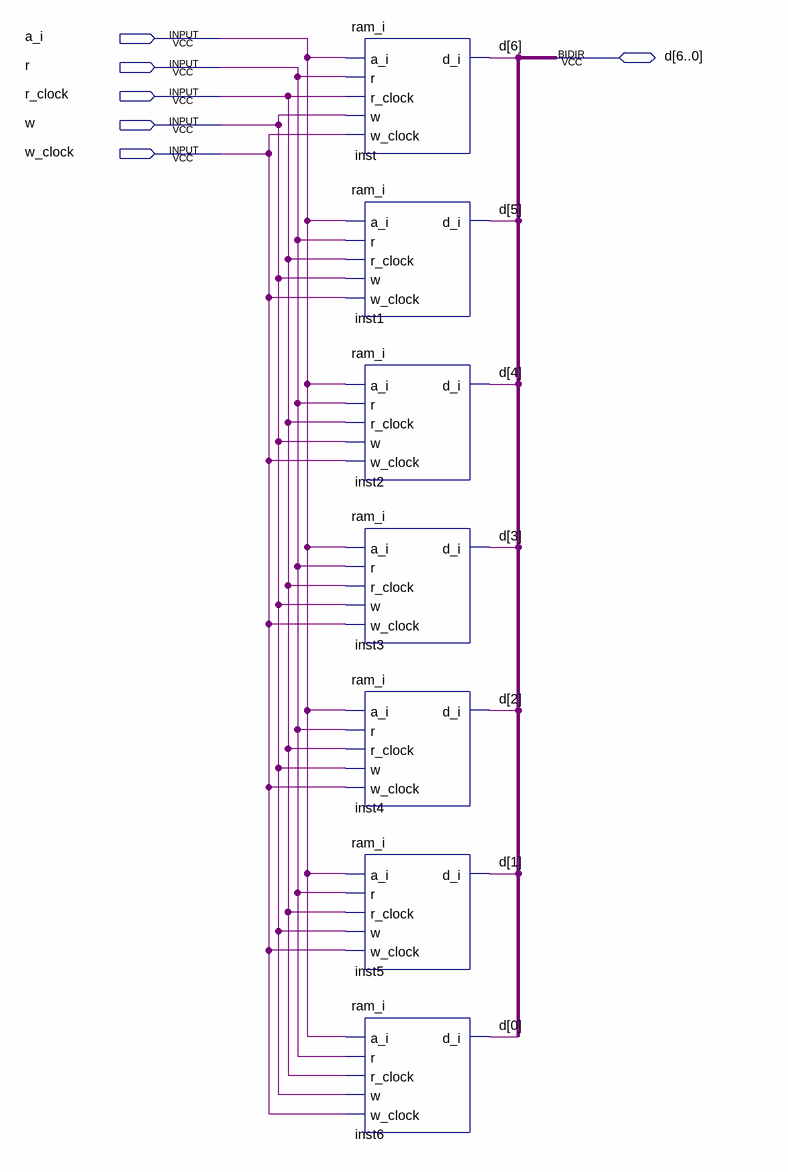
[diagram p0: schematic sheet]
// Quartus schematic ram_7.bdf as structural Verilog: 7 symbols, 6 pins
module ram_7 (
  input  a_i,
  input  r,
  input  r_clock,
  input  w,
  input  w_clock,
  inout  [6:0] d
);

  ram_i inst (.a_i(a_i), .r(r), .r_clock(r_clock), .w(w), .w_clock(w_clock), .d_i(d[6]));
  ram_i inst1 (.a_i(a_i), .r(r), .r_clock(r_clock), .w(w), .w_clock(w_clock), .d_i(d[5]));
  ram_i inst2 (.a_i(a_i), .r(r), .r_clock(r_clock), .w(w), .w_clock(w_clock), .d_i(d[4]));
  ram_i inst3 (.a_i(a_i), .r(r), .r_clock(r_clock), .w(w), .w_clock(w_clock), .d_i(d[3]));
  ram_i inst4 (.a_i(a_i), .r(r), .r_clock(r_clock), .w(w), .w_clock(w_clock), .d_i(d[2]));
  ram_i inst5 (.a_i(a_i), .r(r), .r_clock(r_clock), .w(w), .w_clock(w_clock), .d_i(d[1]));
  ram_i inst6 (.a_i(a_i), .r(r), .r_clock(r_clock), .w(w), .w_clock(w_clock), .d_i(d[0]));
endmodule
